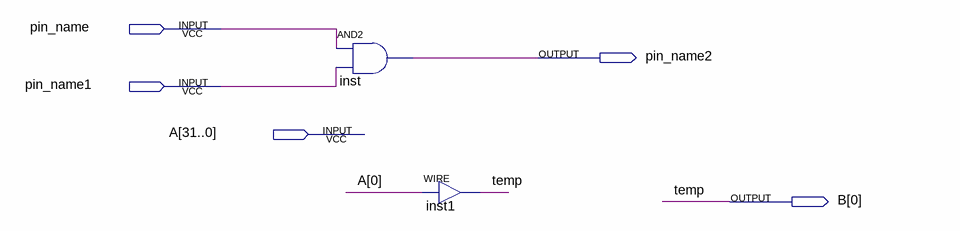
[diagram p0: schematic sheet]
// Quartus schematic COD_try_1.bdf as structural Verilog: 2 symbols, 5 pins
module COD_try_1 (
  input  pin_name,
  input  pin_name1,
  input  [31:0] A,
  output pin_name2,
  output [0:0] B
);

  and inst (pin_name2, pin_name, pin_name1);
  assign B[0] = A[0];  // WIRE inst1

  // Other names for the same wires on the sheet: temp = B[0]
endmodule
